# EAGLE schematic projeto_micro_11965988 (EAGLE 9.6.2)
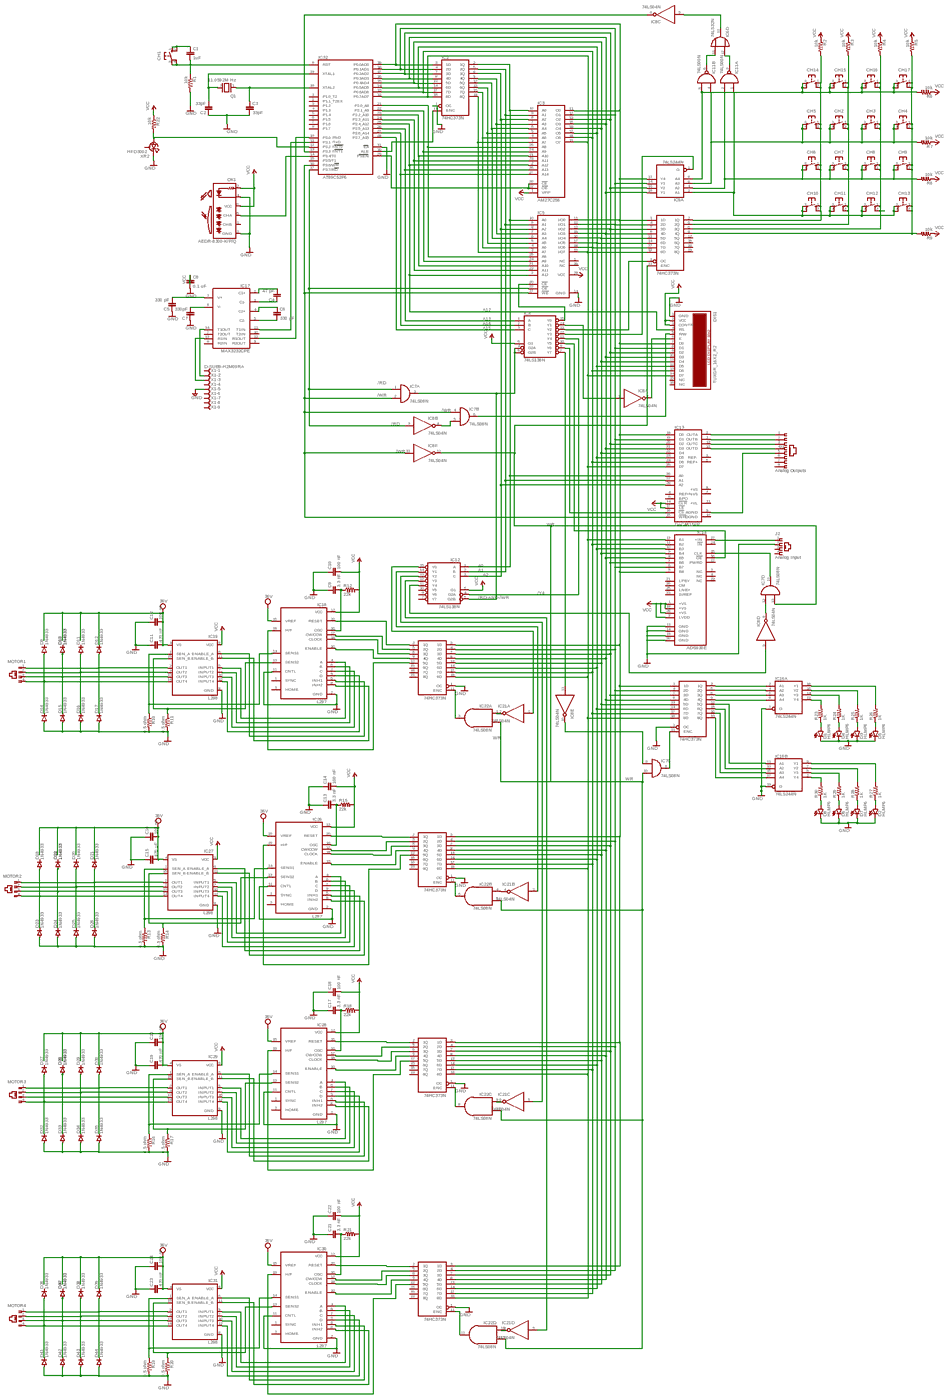
[diagram p0: schematic, sheet 1, overview]
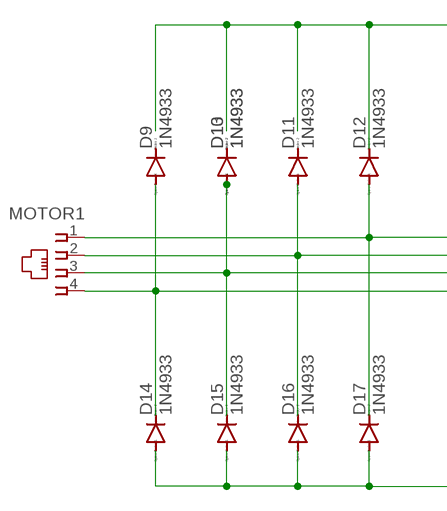
[diagram p1: schematic, sheet 1, part 1 of 4]
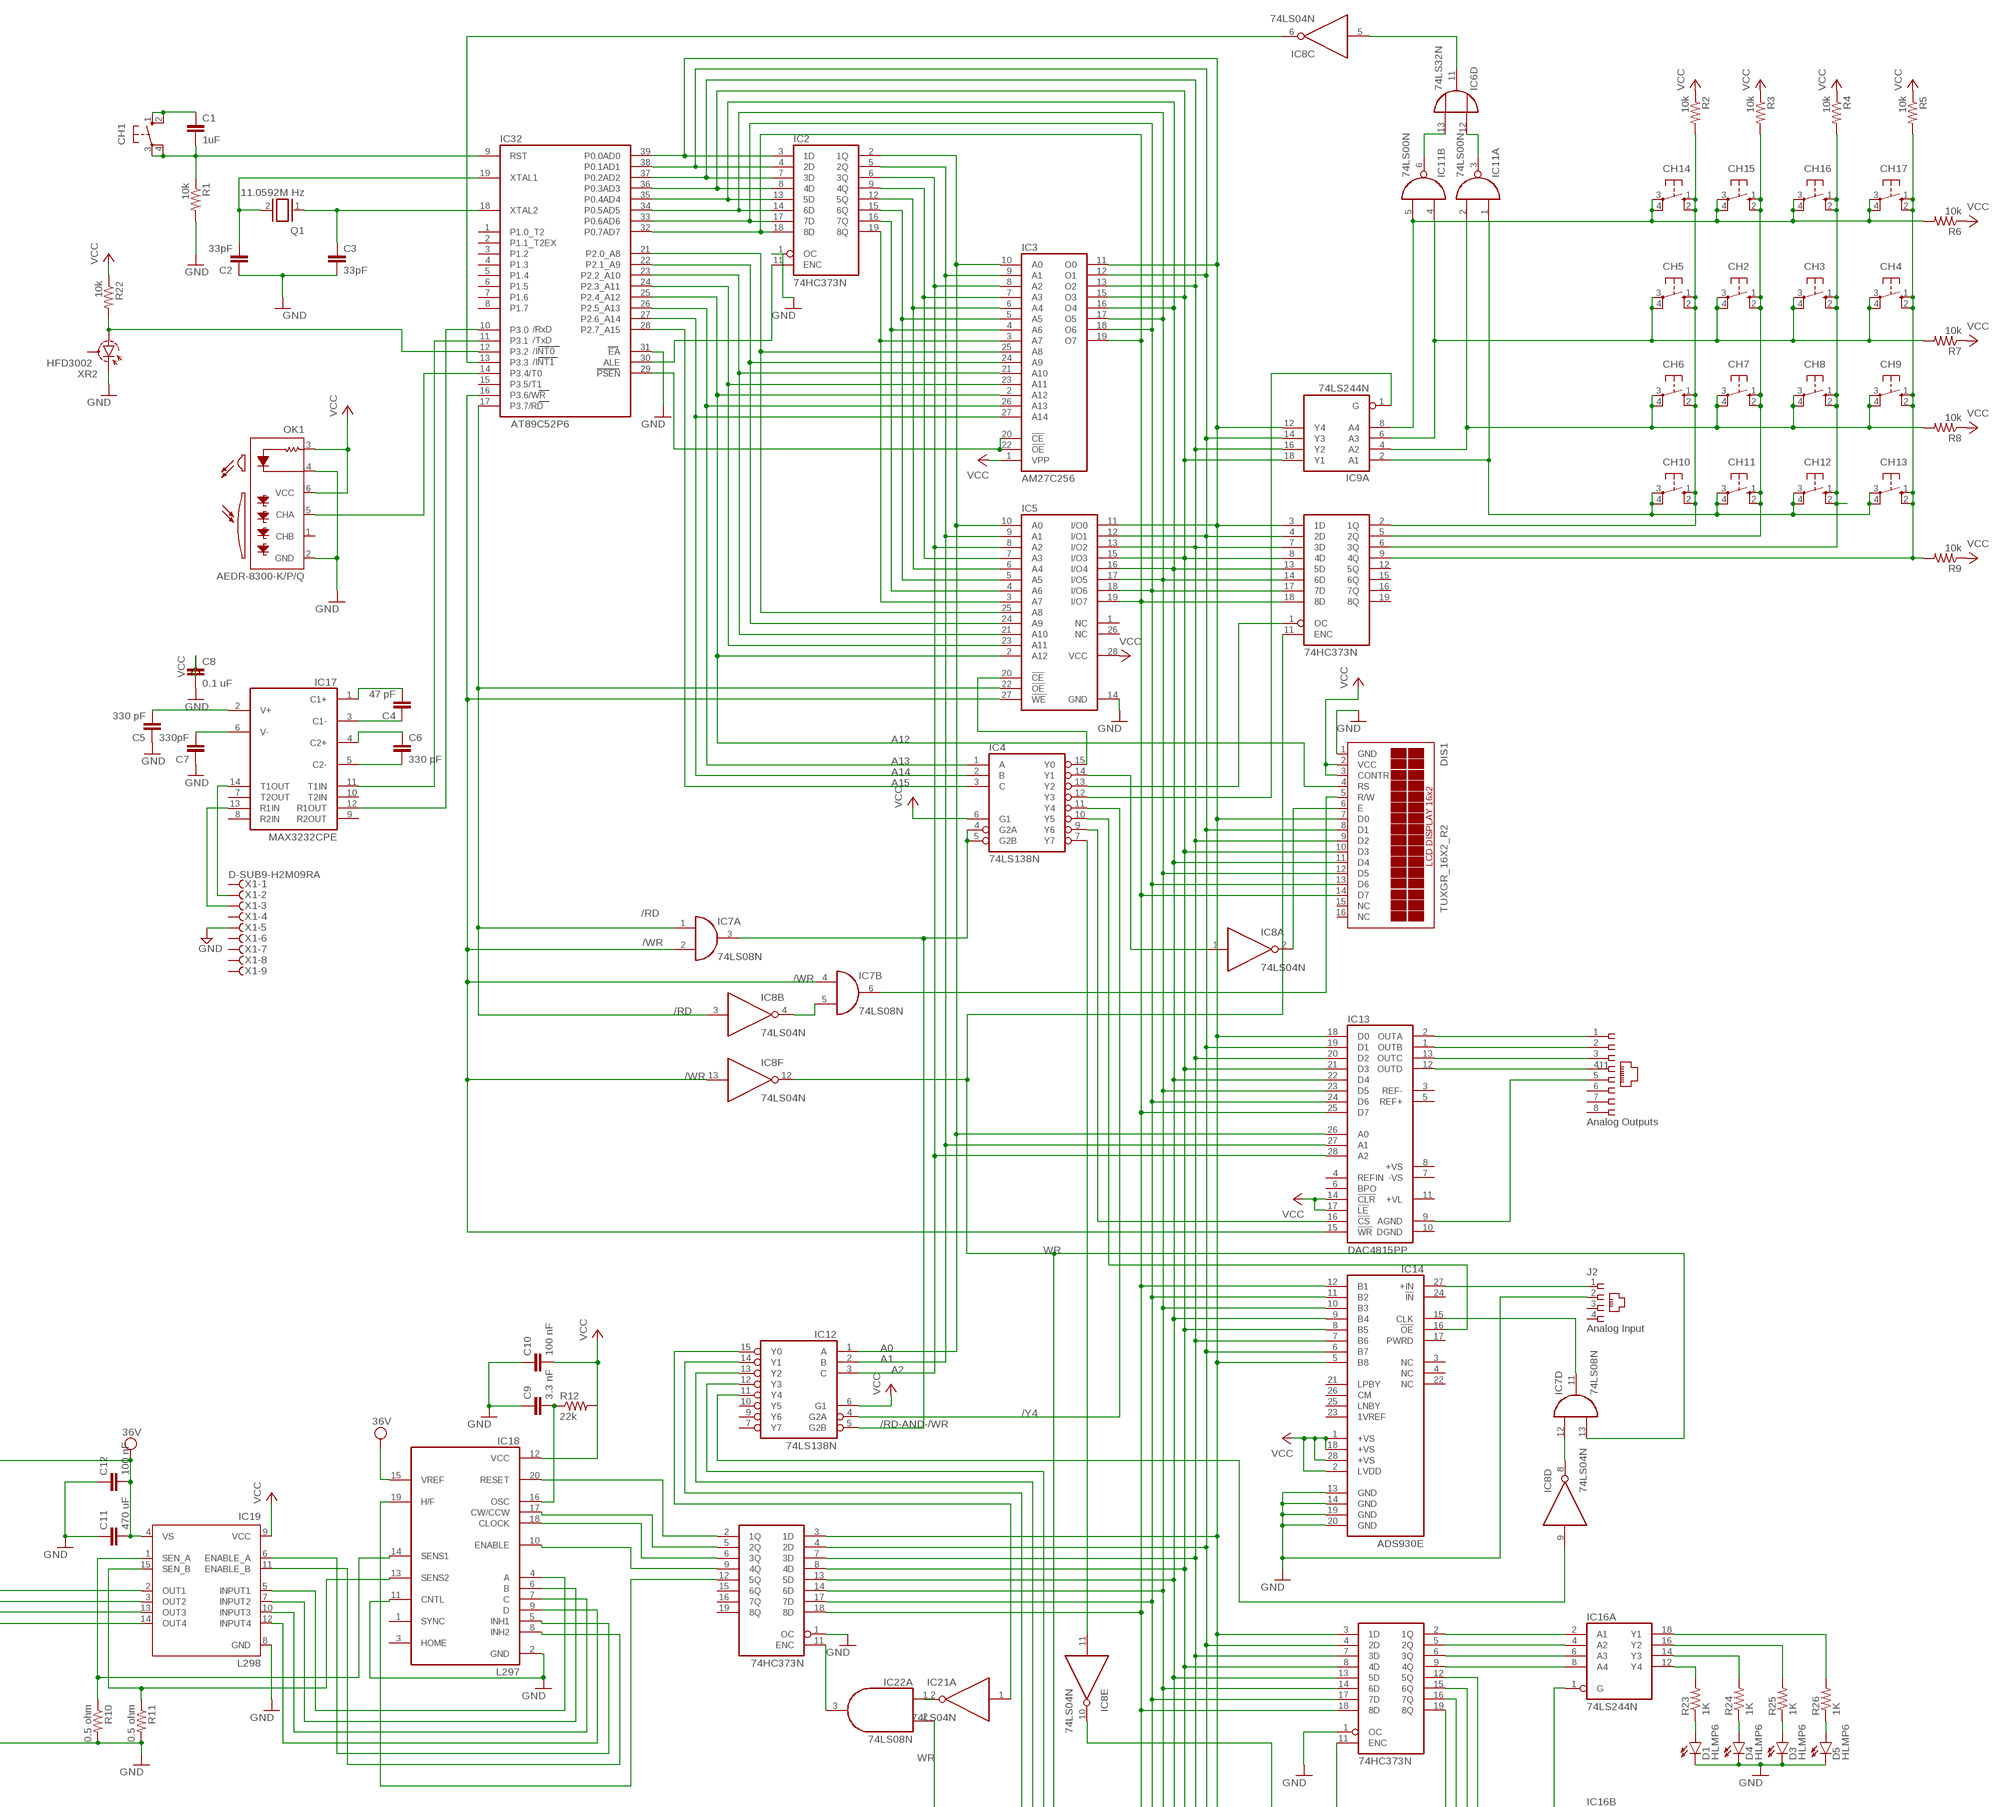
[diagram p2: schematic, sheet 1, part 2 of 4]
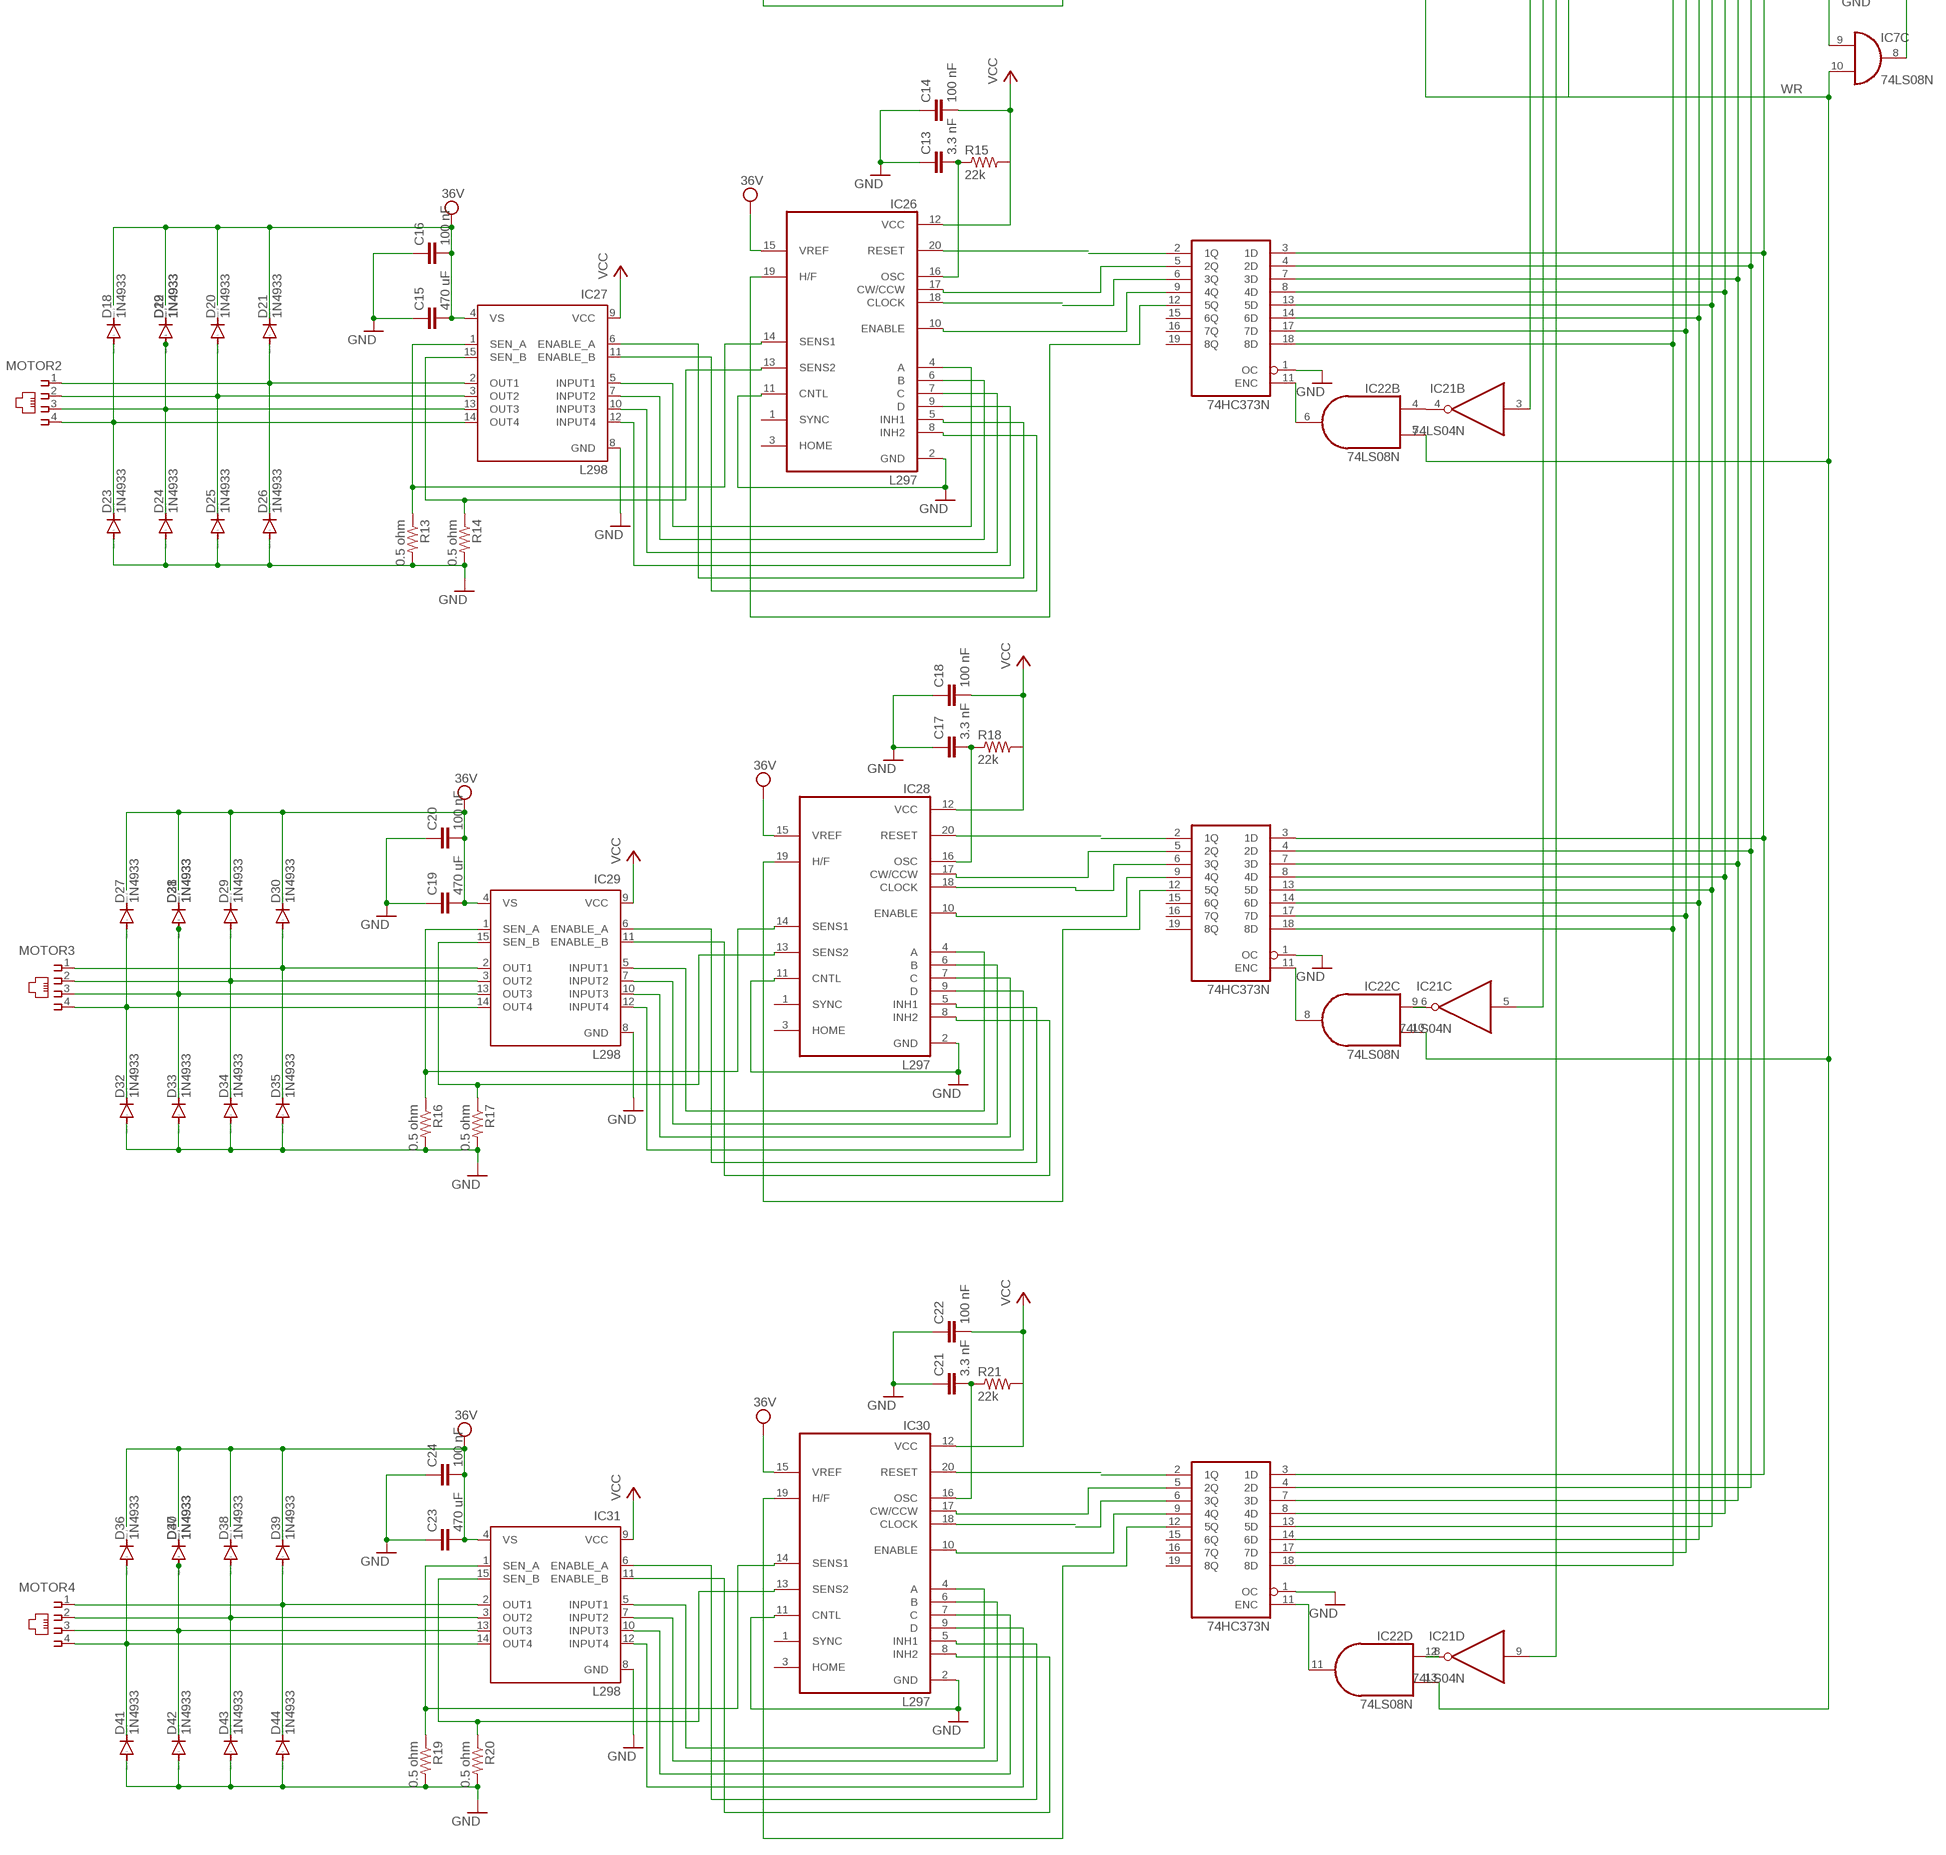
[diagram p3: schematic, sheet 1, part 3 of 4]
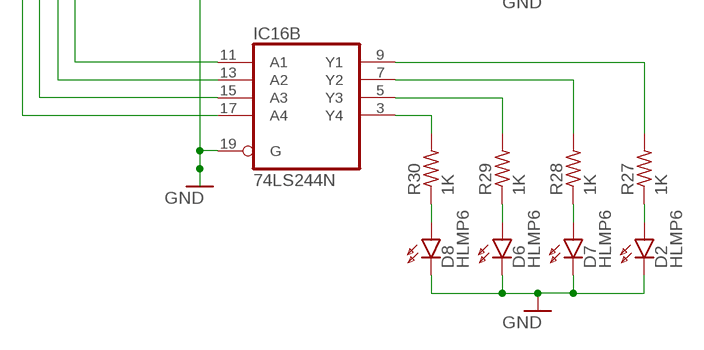
[diagram p4: schematic, sheet 1, part 4 of 4]

## Parts
C1  1uF  C2,5-3  [C2.5-3]
C2  33pF  C2.5/2  [C2.5-2]
C3  33pF  C2.5/2  [C2.5-2]
C4  47 pF  C2.5/2  [C2.5-2]
C5  330 pF  C2.5/2  [C2.5-2]
C6  330 pF  C2.5/2  [C2.5-2]
C7  330pF  C2.5/2  [C2.5-2]
C8  0.1 uF  C2.5/2  [C2.5-2]
C9  3.3 nF  C2.5/2  [C2.5-2]
C10  100 nF  C2.5/2  [C2.5-2]
C11  470 uF  C2.5/2  [C2.5-2]
C12  100 nF  C2.5/2  [C2.5-2]
C13  3.3 nF  C2.5/2  [C2.5-2]
C14  100 nF  C2.5/2  [C2.5-2]
C15  470 uF  C2.5/2  [C2.5-2]
C16  100 nF  C2.5/2  [C2.5-2]
C17  3.3 nF  C2.5/2  [C2.5-2]
C18  100 nF  C2.5/2  [C2.5-2]
C19  470 uF  C2.5/2  [C2.5-2]
C20  100 nF  C2.5/2  [C2.5-2]
C21  3.3 nF  C2.5/2  [C2.5-2]
C22  100 nF  C2.5/2  [C2.5-2]
C23  470 uF  C2.5/2  [C2.5-2]
C24  100 nF  C2.5/2  [C2.5-2]
CH1  10-XX  [B3F-10XX]
CH2  10-XX  [B3F-10XX]
CH3  10-XX  [B3F-10XX]
CH4  10-XX  [B3F-10XX]
CH5  10-XX  [B3F-10XX]
CH6  10-XX  [B3F-10XX]
CH7  10-XX  [B3F-10XX]
CH8  10-XX  [B3F-10XX]
CH9  10-XX  [B3F-10XX]
CH10  10-XX  [B3F-10XX]
CH11  10-XX  [B3F-10XX]
CH12  10-XX  [B3F-10XX]
CH13  10-XX  [B3F-10XX]
CH14  10-XX  [B3F-10XX]
CH15  10-XX  [B3F-10XX]
CH16  10-XX  [B3F-10XX]
CH17  10-XX  [B3F-10XX]
D1  HLMP6  [HLMP6]
D2  HLMP6  [HLMP6]
D3  HLMP6  [HLMP6]
D4  HLMP6  [HLMP6]
D5  HLMP6  [HLMP6]
D6  HLMP6  [HLMP6]
D7  HLMP6  [HLMP6]
D8  HLMP6  [HLMP6]
D9  1N4933  [DO41-10]
D10  1N4933  [DO41-10]
D11  1N4933  [DO41-10]
D12  1N4933  [DO41-10]
D13  1N4933  [DO41-10]
D14  1N4933  [DO41-10]
D15  1N4933  [DO41-10]
D16  1N4933  [DO41-10]
D17  1N4933  [DO41-10]
D18  1N4933  [DO41-10]
D19  1N4933  [DO41-10]
D20  1N4933  [DO41-10]
D21  1N4933  [DO41-10]
D22  1N4933  [DO41-10]
D23  1N4933  [DO41-10]
D24  1N4933  [DO41-10]
D25  1N4933  [DO41-10]
D26  1N4933  [DO41-10]
D27  1N4933  [DO41-10]
D28  1N4933  [DO41-10]
D29  1N4933  [DO41-10]
D30  1N4933  [DO41-10]
D31  1N4933  [DO41-10]
D32  1N4933  [DO41-10]
D33  1N4933  [DO41-10]
D34  1N4933  [DO41-10]
D35  1N4933  [DO41-10]
D36  1N4933  [DO41-10]
D37  1N4933  [DO41-10]
D38  1N4933  [DO41-10]
D39  1N4933  [DO41-10]
D40  1N4933  [DO41-10]
D41  1N4933  [DO41-10]
D42  1N4933  [DO41-10]
D43  1N4933  [DO41-10]
D44  1N4933  [DO41-10]
DIS1  TUXGR_16X2_R2  [TUXGR_16X2_R2]
IC2  74HC373N  [DIL20]
IC3  AM27C256  27256  [DIL28]
IC4  74LS138N  [DIL16]
IC5  28C64C  [DIL28-6]
IC6  74LS32N  [DIL14]
IC7  74LS08N  [DIL14]
IC8  74LS04N  [DIL14]
IC9  74LS244N  [DIL20]
IC10  74HC373N  [DIL20]
IC11  74LS00N  [DIL14]
IC12  74LS138N  [DIL16]
IC13  DAC4815PP  [DIL28]
IC14  ADS930E  [SSOP28BU]
IC15  74HC373N  [DIL20]
IC16  74LS244N  [DIL20]
IC17  MAX3232CPE  [DIL16]
IC18  L297  [DIL20]
IC19  L298  [MULTIWATT-15]
IC20  74HC373N  [DIL20]
IC21  74LS04N  [DIL14]
IC22  74LS08N  [DIL14]
IC23  74HC373N  [DIL20]
IC24  74HC373N  [DIL20]
IC25  74HC373N  [DIL20]
IC26  L297  [DIL20]
IC27  L298  [MULTIWATT-15]
IC28  L297  [DIL20]
IC29  L298  [MULTIWATT-15]
IC30  L297  [DIL20]
IC31  L298  [MULTIWATT-15]
IC32  AT89C52P6  [DIL40]
J1  Analog Outputs  215877-4  [215877-4]
J2  Analog Input  215875-3  [215875-3]
MOTOR1  215876-6  [215876-6]
MOTOR2  215876-6  [215876-6]
MOTOR3  215876-6  [215876-6]
MOTOR4  215876-6  [215876-6]
OK1  AEDR-8300-K/P/Q  [AEDR-8300]
Q1  11.0592M Hz  XTAL  [Q]
R1  10k  R-US_0207/10  [0207/10]
R2  10k  R-US_0207/10  [0207/10]
R3  10k  R-US_0207/10  [0207/10]
R4  10k  R-US_0207/10  [0207/10]
R5  10k  R-US_0207/10  [0207/10]
R6  10k  R-US_0207/10  [0207/10]
R7  10k  R-US_0207/10  [0207/10]
R8  10k  R-US_0207/10  [0207/10]
R9  10k  R-US_0207/10  [0207/10]
R10  0.5 ohm  R-US_0207/10  [0207/10]
R11  0.5 ohm  R-US_0207/10  [0207/10]
R12  22k  R-US_0207/10  [0207/10]
R13  0.5 ohm  R-US_0207/10  [0207/10]
R14  0.5 ohm  R-US_0207/10  [0207/10]
R15  22k  R-US_0207/10  [0207/10]
R16  0.5 ohm  R-US_0207/10  [0207/10]
R17  0.5 ohm  R-US_0207/10  [0207/10]
R18  22k  R-US_0207/10  [0207/10]
R19  0.5 ohm  R-US_0207/10  [0207/10]
R20  0.5 ohm  R-US_0207/10  [0207/10]
R21  22k  R-US_0207/10  [0207/10]
R22  10k  R-US_0207/10  [0207/10]
R23  1K  R-US_0207/10  [0207/10]
R24  1K  R-US_0207/10  [0207/10]
R25  1K  R-US_0207/10  [0207/10]
R26  1K  R-US_0207/10  [0207/10]
R27  1K  R-US_0207/10  [0207/10]
R28  1K  R-US_0207/10  [0207/10]
R29  1K  R-US_0207/10  [0207/10]
R30  1K  R-US_0207/10  [0207/10]
X1  D-SUB9-H2M09RA  [H2M09RA]
XR2  HFD3002  [TO46-FW3]

## Nets
/RD: IC5.22(!OE) IC7.1(A:I0) IC8.3(B:I) IC32.17(P3.7/RD)
/RD-AND-/WR: IC4.4(G2A) IC4.5(G2B) IC7.3(A:O) IC12.5(G2B)
/WR: IC5.27(!WE) IC7.2(A:I1) IC7.4(B:I0) IC8.13(F:I) IC13.15(!WR) IC32.16(P3.6/WR)
/Y4: IC4.11(Y4) IC12.4(G2A)
A0: IC2.2(1Q) IC3.10(A0) IC5.10(A0) IC12.1(A) IC13.26(A0)
A1: IC2.5(2Q) IC3.9(A1) IC5.9(A1) IC12.2(B) IC13.27(A1)
A2: IC2.6(3Q) IC3.8(A2) IC5.8(A2) IC12.3(C) IC13.28(A2)
A12: DIS1.4(RS) IC3.2(A12) IC5.2(A12) IC32.25(P2.4_A12)
A13: IC3.26(A13) IC4.1(A) IC32.26(P2.5_A13)
A14: IC3.27(A14) IC4.2(B) IC32.27(P2.6_A14)
A15: IC4.3(C) IC32.28(P2.7_A15)
GND: C2.1 C3.2 C5.1 C7.1 C8.2 C9.1 C10.1 C11.1 C12.1 C13.1 C14.1 C15.1 C16.1 C17.1 C18.1 C19.1 C20.1 C21.1 C22.1 C23.1 C24.1 D1.K D2.K D3.K D4.K D5.K D6.K D7.K D8.K D14.A D15.A D16.A D17.A D23.A D24.A D25.A D26.A D32.A D33.A D34.A D35.A D41.A D42.A D43.A D44.A DIS1.1(GND) IC2.1(OC) IC5.14(GND) IC14.13(GND) IC14.14(GND) IC14.19(GND) IC14.20(GND) IC15.1(OC) IC16.1(A:G) IC16.19(B:G) IC18.2(GND) IC18.11(CNTL) IC19.8(GND) IC20.1(OC) IC23.1(OC) IC24.1(OC) IC25.1(OC) IC26.2(GND) IC26.11(CNTL) IC27.8(GND) IC28.2(GND) IC28.11(CNTL) IC29.8(GND) IC30.2(GND) IC30.11(CNTL) IC31.8(GND) IC32.31(EA) J2.2 OK1.2(GND) OK1.4(C) R1.2 R10.2 R11.2 R13.2 R14.2 R16.2 R17.2 R19.2 R20.2 X1.5 XR2.2(C)
N$1: C2.2 IC32.19(XTAL1) Q1.2
N$2: C1.1 CH1.1(S) CH1.2(S1)
N$3: C1.2 CH1.3(P) CH1.4(P1) IC32.9(RST) R1.1
N$4: C3.1 IC32.18(XTAL2) Q1.1
N$5: DIS1.7(D0) IC2.3(1D) IC3.11(O0) IC5.11(I/O0) IC9.12(A:Y4) IC10.3(1D) IC13.18(D0) IC14.5(B8) IC15.3(1D) IC20.3(1D) IC23.3(1D) IC24.3(1D) IC25.3(1D) IC32.39(P0.0AD0)
N$6: DIS1.8(D1) IC2.4(2D) IC3.12(O1) IC5.12(I/O1) IC9.14(A:Y3) IC10.4(2D) IC13.19(D1) IC14.6(B7) IC15.4(2D) IC20.4(2D) IC23.4(2D) IC24.4(2D) IC25.4(2D) IC32.38(P0.1AD1)
N$7: DIS1.9(D2) IC2.7(3D) IC3.13(O2) IC5.13(I/O2) IC9.16(A:Y2) IC10.7(3D) IC13.20(D2) IC14.7(B6) IC15.7(3D) IC20.7(3D) IC23.7(3D) IC24.7(3D) IC25.7(3D) IC32.37(P0.2AD2)
N$8: DIS1.10(D3) IC2.8(4D) IC3.15(O3) IC5.15(I/O3) IC9.18(A:Y1) IC10.8(4D) IC13.21(D3) IC14.8(B5) IC15.8(4D) IC20.8(4D) IC23.8(4D) IC24.8(4D) IC25.8(4D) IC32.36(P0.3AD3)
N$9: DIS1.11(D4) IC2.13(5D) IC3.16(O4) IC5.16(I/O4) IC10.13(5D) IC13.22(D4) IC14.9(B4) IC15.13(5D) IC20.13(5D) IC23.13(5D) IC24.13(5D) IC25.13(5D) IC32.35(P0.4AD4)
N$10: DIS1.12(D5) IC2.14(6D) IC3.17(O5) IC5.17(I/O5) IC10.14(6D) IC13.23(D5) IC14.10(B3) IC15.14(6D) IC20.14(6D) IC23.14(6D) IC24.14(6D) IC25.14(6D) IC32.34(P0.5AD5)
N$11: DIS1.13(D6) IC2.17(7D) IC3.18(O6) IC5.18(I/O6) IC10.17(7D) IC13.24(D6) IC14.11(B2) IC15.17(7D) IC20.17(7D) IC23.17(7D) IC24.17(7D) IC25.17(7D) IC32.33(P0.6AD6)
N$12: DIS1.14(D7) IC2.18(8D) IC3.19(O7) IC5.19(I/O7) IC10.18(8D) IC13.25(D7) IC14.12(B1) IC15.18(8D) IC20.18(8D) IC23.18(8D) IC24.18(8D) IC25.18(8D) IC32.32(P0.7AD7)
N$13: IC2.19(8Q) IC3.3(A7) IC5.3(A7)
N$14: IC2.16(7Q) IC3.4(A6) IC5.4(A6)
N$15: IC2.15(6Q) IC3.5(A5) IC5.5(A5)
N$16: IC2.12(5Q) IC3.6(A4) IC5.6(A4)
N$17: IC2.9(4Q) IC3.7(A3) IC5.7(A3)
N$18: IC13.2(OUTA) J1.1
N$19: IC13.1(OUTB) J1.2
N$20: IC13.13(OUTC) J1.3
N$21: IC3.25(A8) IC5.25(A8) IC32.21(P2.0_A8)
N$22: IC3.24(A9) IC5.24(A9) IC32.22(P2.1_A9)
N$23: IC3.21(A10) IC5.21(A10) IC32.23(P2.2_A10)
N$24: IC3.23(A11) IC5.23(A11) IC32.24(P2.3_A11)
N$25: IC13.12(OUTD) J1.4
N$26: IC13.9(AGND) J1.5
N$27: IC14.27(+IN) J2.1
N$28: IC7.12(D:I0) IC8.8(D:O)
N$29: IC8.9(D:I) IC12.11(Y4)
N$31: IC3.20(!CE) IC3.22(!OE) IC32.29(PSEN)
N$32: IC7.11(D:O) IC14.15(CLK)
N$33: IC7.5(B:I1) IC8.4(B:O)
N$34: IC2.11(ENC) IC32.30(ALE)
N$38: DIS1.6(E) IC8.2(A:O)
N$39: IC4.14(Y1) IC8.1(A:I)
N$40: DIS1.5(R/W) IC7.6(B:O)
N$41: IC4.13(Y2) IC10.1(OC)
N$42: IC4.12(Y3) IC9.1(A:G)
N$43: IC6.12(D:I0) IC11.3(A:O)
N$44: IC6.13(D:I1) IC11.6(B:O)
N$45: IC6.11(D:O) IC8.5(C:I)
N$46: C4.1 IC17.3(C1-)
N$47: C4.2 IC17.1(C1+)
N$48: C5.2 IC17.2(V+)
N$49: C6.2 IC17.5(C2-)
N$50: IC8.6(C:O) IC32.13(P3.3)
N$51: IC4.9(Y6) IC13.16(!CS)
N$53: IC4.10(Y5) IC14.16(!OE)
N$55: IC7.9(C:I0) IC8.10(E:O)
N$56: IC15.2(1Q) IC16.2(A:A1)
N$57: IC21.6(C:O) IC22.9(C:I0)
N$58: IC7.8(C:O) IC15.11(ENC)
N$59: IC15.5(2Q) IC16.4(A:A2)
N$60: IC15.6(3Q) IC16.6(A:A3)
N$61: IC15.9(4Q) IC16.8(A:A4)
N$62: IC15.19(8Q) IC16.17(B:A4)
N$63: IC15.16(7Q) IC16.15(B:A3)
N$64: IC15.15(6Q) IC16.13(B:A2)
N$65: IC15.12(5Q) IC16.11(B:A1)
N$66: D1.A IC16.12(A:Y4) R23.1 R23.2
N$67: D4.A R24.1
N$68: D3.A R25.1
N$69: D5.A R26.1
N$70: D8.A IC16.3(B:Y4) R30.1 R30.2
N$71: D6.A R29.1
N$72: D7.A R28.1
N$73: D2.A R27.1
N$74: CH5.1(S) CH5.2(S1) CH6.1(S) CH6.2(S1) CH10.1(S) CH10.2(S1) CH14.1(S) CH14.2(S1) IC10.2(1Q) R2.2
N$75: CH2.1(S) CH2.2(S1) CH7.1(S) CH7.2(S1) CH11.1(S) CH11.2(S1) CH15.1(S) CH15.2(S1) IC10.5(2Q) R3.2
N$76: CH3.1(S) CH3.2(S1) CH8.1(S) CH8.2(S1) CH12.1(S) CH12.2(S1) CH16.1(S) CH16.2(S1) IC10.6(3Q) R4.2
N$77: CH4.1(S) CH4.2(S1) CH9.1(S) CH9.2(S1) CH13.1(S) CH13.2(S1) CH17.1(S) CH17.2(S1) IC10.9(4Q) R5.2 R9.2
N$78: C6.1 IC17.4(C2+)
N$79: C7.2 IC17.6(V-)
N$80: CH14.3(P) CH14.4(P1) CH15.3(P) CH15.4(P1) CH16.3(P) CH16.4(P1) CH17.3(P) CH17.4(P1) IC9.8(A:A4) IC11.5(B:I1) R6.2
N$81: IC17.11(T1IN) IC32.11(P3.1)
N$82: IC17.12(R1OUT) IC32.10(P3.0)
N$83: IC17.14(T1OUT) X1.2
N$84: CH2.3(P) CH2.4(P1) CH3.3(P) CH3.4(P1) CH4.3(P) CH4.4(P1) CH5.3(P) CH5.4(P1) IC9.6(A:A3) IC11.4(B:I0) R7.2
N$85: IC17.13(R1IN) X1.3
N$86: IC20.11(ENC) IC22.3(A:O)
N$87: IC12.15(Y0) IC21.1(A:I)
N$88: CH6.3(P) CH6.4(P1) CH7.3(P) CH7.4(P1) CH8.3(P) CH8.4(P1) CH9.3(P) CH9.4(P1) IC9.4(A:A2) IC11.2(A:I1) R8.2
N$89: IC21.2(A:O) IC22.1(A:I0)
N$90: IC4.7(Y7) IC8.11(E:I)
N$91: IC21.8(D:O) IC22.12(D:I0)
N$92: CH10.3(P) CH10.4(P1) CH11.3(P) CH11.4(P1) CH12.3(P) CH12.4(P1) CH13.3(P) CH13.4(P1) IC9.2(A:A1) IC11.1(A:I0)
N$93: IC21.4(B:O) IC22.4(B:I0)
N$94: IC12.14(Y1) IC21.3(B:I)
N$95: IC12.13(Y2) IC21.5(C:I)
N$96: IC12.12(Y3) IC21.9(D:I)
N$97: IC18.20(RESET) IC20.2(1Q)
N$98: IC18.4(A) IC19.5(INPUT1)
N$99: IC22.6(B:O) IC23.11(ENC)
N$100: IC22.8(C:O) IC24.11(ENC)
N$101: IC22.11(D:O) IC25.11(ENC)
N$102: IC18.18(CLOCK) IC20.6(3Q)
N$103: IC18.10(ENABLE) IC20.9(4Q)
N$104: IC18.17(CW/CCW) IC20.5(2Q)
N$105: C9.2 IC18.16(OSC) R12.1
N$106: IC18.6(B) IC19.7(INPUT2)
N$107: IC18.7(C) IC19.10(INPUT3)
N$108: IC18.9(D) IC19.12(INPUT4)
N$109: IC18.5(INH1) IC19.6(ENABLE_A)
N$110: IC18.8(INH2) IC19.11(ENABLE_B)
N$111: IC18.14(SENS1) IC19.1(SEN_A) R10.1
N$112: IC18.13(SENS2) IC19.15(SEN_B) R11.1
N$113: D9.A D14.C IC19.14(OUT4) MOTOR1.4
N$114: D10.A D13.A D15.C IC19.13(OUT3) MOTOR1.3
N$115: D10.C D13.C
N$116: D11.A D16.C IC19.3(OUT2) MOTOR1.2
N$117: D12.A D17.C IC19.2(OUT1) MOTOR1.1
N$118: IC18.19(H/F) IC20.12(5Q)
N$119: IC23.2(1Q)
N$120: IC26.20(RESET)
N$121: IC26.18(CLOCK)
N$122: IC23.9(4Q) IC26.10(ENABLE)
N$123: IC23.5(2Q) IC26.17(CW/CCW)
N$124: IC26.4(A) IC27.5(INPUT1)
N$125: IC26.6(B) IC27.7(INPUT2)
N$126: IC26.7(C) IC27.10(INPUT3)
N$127: IC26.9(D) IC27.12(INPUT4)
N$128: IC26.5(INH1) IC27.6(ENABLE_A)
N$129: IC26.8(INH2) IC27.11(ENABLE_B)
N$130: IC26.14(SENS1) IC27.1(SEN_A) R13.1
N$131: IC26.13(SENS2) IC27.15(SEN_B) R14.1
N$132: C13.2 IC26.16(OSC) R15.1
N$133: D19.A D22.A D24.C IC27.13(OUT3) MOTOR2.3
N$134: D19.C D22.C
N$135: D18.A D23.C IC27.14(OUT4) MOTOR2.4
N$136: D20.A D25.C IC27.3(OUT2) MOTOR2.2
N$137: D21.A D26.C IC27.2(OUT1) MOTOR2.1
N$138: IC23.12(5Q) IC26.19(H/F)
N$139: IC28.20(RESET)
N$140: IC24.6(3Q) IC28.18(CLOCK)
N$141: IC24.9(4Q) IC28.10(ENABLE)
N$142: IC24.5(2Q) IC28.17(CW/CCW)
N$143: IC28.4(A) IC29.5(INPUT1)
N$144: IC28.6(B) IC29.7(INPUT2)
N$145: IC28.7(C) IC29.10(INPUT3)
N$146: IC28.9(D) IC29.12(INPUT4)
N$147: IC28.5(INH1) IC29.6(ENABLE_A)
N$148: IC28.8(INH2) IC29.11(ENABLE_B)
N$149: IC28.14(SENS1) IC29.1(SEN_A) R16.1
N$150: IC28.13(SENS2) IC29.15(SEN_B) R17.1
N$151: C17.2 IC28.16(OSC) R18.1
N$152: D28.A D31.A D33.C IC29.13(OUT3) MOTOR3.3
N$153: D28.C D31.C
N$154: D27.A D32.C IC29.14(OUT4) MOTOR3.4
N$155: D29.A D34.C IC29.3(OUT2) MOTOR3.2
N$156: D30.A D35.C IC29.2(OUT1) MOTOR3.1
N$157: IC24.12(5Q) IC28.19(H/F)
N$158: IC30.20(RESET)
N$159: IC30.18(CLOCK)
N$160: IC25.9(4Q) IC30.10(ENABLE)
N$161: IC25.5(2Q) IC30.17(CW/CCW)
N$162: IC30.4(A) IC31.5(INPUT1)
N$163: IC30.6(B) IC31.7(INPUT2)
N$164: IC30.7(C) IC31.10(INPUT3)
N$165: IC30.9(D) IC31.12(INPUT4)
N$166: IC30.5(INH1) IC31.6(ENABLE_A)
N$167: IC30.8(INH2) IC31.11(ENABLE_B)
N$168: IC30.14(SENS1) IC31.1(SEN_A) R19.1
N$169: IC30.13(SENS2) IC31.15(SEN_B) R20.1
N$170: C21.2 IC30.16(OSC) R21.1
N$171: D37.A D40.A D42.C IC31.13(OUT3) MOTOR4.3
N$172: D37.C D40.C
N$173: D36.A D41.C IC31.14(OUT4) MOTOR4.4
N$174: D38.A D43.C IC31.3(OUT2) MOTOR4.2
N$175: D39.A D44.C IC31.2(OUT1) MOTOR4.1
N$176: IC25.12(5Q) IC30.19(H/F)
N$177: IC23.6(3Q)
N$178: IC24.2(1Q)
N$179: IC25.2(1Q)
N$180: IC25.6(3Q)
N$181: IC32.14(P3.4/T0) OK1.5(CHA)
N$182: IC32.12(P3.2) R22.2 XR2.1(A)
N$183: IC16.14(A:Y3) R24.2
N$184: IC16.16(A:Y2) R25.2
N$185: IC16.18(A:Y1) R26.2
N$186: IC4.15(Y0) IC5.20(!CE)
N$187: IC16.5(B:Y3) R29.2
N$188: IC16.7(B:Y2) R28.2
N$189: IC16.9(B:Y1) R27.2
VCC: C8.1 C10.2 C11.2 C12.2 C14.2 C15.2 C16.2 C18.2 C19.2 C20.2 C22.2 C23.2 C24.2 D12.C D21.C D30.C D39.C DIS1.2(VCC) DIS1.3(CONTR) IC3.1(VPP) IC4.6(G1) IC5.28(VCC) IC12.6(G1) IC13.14(!CLR) IC13.17(!LE) IC14.1(+VS) IC14.2(LVDD) IC14.18(+VS) IC14.28(+VS) IC18.12(VCC) IC18.15(VREF) IC19.4(VS) IC19.9(VCC) IC26.12(VCC) IC26.15(VREF) IC27.4(VS) IC27.9(VCC) IC28.12(VCC) IC28.15(VREF) IC29.4(VS) IC29.9(VCC) IC30.12(VCC) IC30.15(VREF) IC31.4(VS) IC31.9(VCC) OK1.3(A) OK1.6(VCC) R2.1 R3.1 R4.1 R5.1 R6.1 R7.1 R8.1 R9.1 R12.2 R15.2 R18.2 R21.2 R22.1 ; supply symbol labelled 36V
WR: IC7.10(C:I1) IC7.13(D:I1) IC8.12(F:O) IC10.11(ENC) IC22.2(A:I1) IC22.5(B:I1) IC22.10(C:I1) IC22.13(D:I1)
Unconnected: D9.C D11.C D18.C D20.C D27.C D29.C D36.C D38.C DIS1.15(NC) DIS1.16(NC) IC5.1(NC) IC5.26(NC) IC6.1(A:I0) IC6.2(A:I1) IC6.3(A:O) IC6.4(B:I0) IC6.5(B:I1) IC6.6(B:O) IC6.8(C:O) IC6.9(C:I0) IC6.10(C:I1) IC9.3(B:Y4) IC9.5(B:Y3) IC9.7(B:Y2) IC9.9(B:Y1) IC9.11(B:A1) IC9.13(B:A2) IC9.15(B:A3) IC9.17(B:A4) IC9.19(B:G) IC10.12(5Q) IC10.15(6Q) IC10.16(7Q) IC10.19(8Q) IC11.8(C:O) IC11.9(C:I0) IC11.10(C:I1) IC11.11(D:O) IC11.12(D:I0) IC11.13(D:I1) IC12.7(Y7) IC12.9(Y6) IC12.10(Y5) IC13.3(REF-) IC13.4(REFIN) IC13.5(REF+) IC13.6(BPO) IC14.3(NC) IC14.4(NC) IC14.17(PWRD) IC14.21(LPBY) IC14.22(NC) IC14.23(1VREF) IC14.24(!IN) IC14.25(LNBY) IC14.26(CM) IC17.7(T2OUT) IC17.8(R2IN) IC17.9(R2OUT) IC17.10(T2IN) IC18.1(SYNC) IC18.3(HOME) IC20.15(6Q) IC20.16(7Q) IC20.19(8Q) IC21.10(E:O) IC21.11(E:I) IC21.12(F:O) IC21.13(F:I) IC23.15(6Q) IC23.16(7Q) IC23.19(8Q) IC24.15(6Q) IC24.16(7Q) IC24.19(8Q) IC25.15(6Q) IC25.16(7Q) IC25.19(8Q) IC26.1(SYNC) IC26.3(HOME) IC28.1(SYNC) IC28.3(HOME) IC30.1(SYNC) IC30.3(HOME) IC32.1(P1.0_T2) IC32.2(P1.1_T2EX) IC32.3(P1.2) IC32.4(P1.3) IC32.5(P1.4) IC32.6(P1.5) IC32.7(P1.6) IC32.8(P1.7) IC32.15(P3.5/T1) J1.6 J1.7 J1.8 J2.3 J2.4 OK1.1(CHB) X1.1 X1.4 X1.6 X1.7 X1.8 X1.9 XR2.3(S)

## Power pins joined to a net without a drawn wire
+VL: IC13.11(+VL)
+VS: IC13.8(+VS)
-VS: IC13.7(-VS)
DGND: IC13.10(DGND)
GND: IC2.10(GND) IC3.14(GND) IC4.8(GND) IC6.7(P:GND) IC7.7(P:GND) IC8.7(P:GND) IC9.10(P:GND) IC10.10(GND) IC11.7(P:GND) IC12.8(GND) IC15.10(GND) IC16.10(P:GND) IC17.15(GND) IC20.10(GND) IC21.7(P:GND) IC22.7(P:GND) IC23.10(GND) IC24.10(GND) IC25.10(GND) IC32.20(GND) OK1.E1(GND) OK1.E2(GND)
VCC: IC2.20(VCC) IC3.28(VCC) IC4.16(VCC) IC6.14(P:VCC) IC7.14(P:VCC) IC8.14(P:VCC) IC9.20(P:VCC) IC10.20(VCC) IC11.14(P:VCC) IC12.16(VCC) IC15.20(VCC) IC16.20(P:VCC) IC17.16(VCC) IC20.20(VCC) IC21.14(P:VCC) IC22.14(P:VCC) IC23.20(VCC) IC24.20(VCC) IC25.20(VCC) IC32.40(VCC)

## Library data of the parts
C1-C24 = capacitor-wima:C: CAPACITOR naming: grid - package width
CH1-CH17 = switch-omron:10-XX: OMRON SWITCH; MPN: B3F-1000; OC_FARNELL: 176432; OC_NEWARK: 36M3542
D1-D8 = display-hp:HLMP6: LED 2mm horizontal; MF: AGILENT TECHNOLOGIES; MPN: HLMP-6500; OC_FARNELL: 1652490; OC_NEWARK: 40K0088
D9-D44 = diode:1N4933: DIODE fast recovery rectifier, 1A
DIS1 = display-lcd:TUXGR_16X2_R2: Tuxgraphics LCD display 16x2 characters reflective, without background light Source: tuxgr_12x2_r2.pdf; OC_FARNELL: unknown; OC_NEWARK: unknown
IC2 IC10 IC15 IC20 IC23-IC25 = 74xx-eu:74*373: Octal D type transparent LATCH, edge triggered
IC3 = memory:27256: MEMORY
IC4 IC12 = 74xx-us:74*138: 3-line to 8-line DECODER/DEMULTIPLEXER
IC5 = memory-nec:28C64C: MEMORY; MPN: AT28C64B-15PU; OC_FARNELL: 1095784; OC_NEWARK: 96K6557
IC6 = 74xx-eu:74*32: Quad 2-input OR gate
IC7 = 74xx-eu:74*08: Quad 2-input AND gate
IC8 = 74xx-eu:74*04: Hex INVERTER
IC9 IC16 = 74xx-eu:74*244: Octal BUFFER and LINE DRIVER, 3-state
IC11 = 74xx-eu:74*00: Quad 2-input NAND gate
IC13 = burr-brown:DAC4815P: Quad 12-Bit DAC 8-Bit Port Interface; OC_FARNELL: unknown; OC_NEWARK: unknown
IC14 = burr-brown:ADS930: 8-Bit, 30 MSPS ADC SE/Diff Inputs Internal Ref. and Low Power, Powerdown; MPN: AD9280ARSZ; OC_FARNELL: 9603727; OC_NEWARK: 19M1009
IC17 = maxim:MAX3232*: True RS-232 Transceivers 3.0V to 5.5V, Low-Power up to 1Mbps, Using Four 0.1µF External Capacitors Source: http://pdfserv.maxim-ic.com/en/ds/MAX3222-MAX3241.pdf; MF: MAXIM; MPN: MAX3232CPE+; OC_FARNELL: 9724494; OC_NEWARK: 68K4626
IC18 IC26 IC28 IC30 = st-microelectronics:L297: STEPPER MOTOR CONTROLLER; MPN: L297/1; OC_FARNELL: 1094209; OC_NEWARK: 56P8258
IC19 IC27 IC29 IC31 = st-microelectronics:L298: DUAL FULL-BRIDGE DRIVER; MPN: L298N; OC_FARNELL: 1589425; OC_NEWARK: 32M1527
IC21 = 74xx-us:74*04: Hex INVERTER
IC22 = 74xx-us:74*08: Quad 2-input AND gate
IC32 = atmel:AT89C*52: MICROCONTROLLER 8 Kbytes FLASH; 2K Bytes EEPROM Compatible with MCS-51 Products at89s8252.pdf; OC_FARNELL: unknown; OC_NEWARK: unknown
J1 = con-amp:215877-4: AMP connector
J2 = con-amp:215875-3: AMP connector
MOTOR1-MOTOR4 = con-amp:215876-6: AMP connector
OK1 = optocoupler:AEDR-8300-K: Agilent AEDR-8300 Series Encoders Reflective Surface Mount Optical Encoder Source: http: http://www.avagotech.com .. AV02-0088EN-1.pdf; MF: AGILENT TECHNOLOGIES; MPN: AEDR-8300-1P2; OC_FARNELL: 1161102; OC_NEWARK: 08J1020
Q1 = special:XTAL: CRYSTAL
R1-R30 = rcl:R-US_: RESISTOR, American symbol; SPICEPREFIX: R
X1 = con-thomas-betts:D-SUB9-: D-Subminiatur Connector Source: Electronioc Interconnects European Edition 1998; OC_FARNELL: unknown; OC_NEWARK: unknown
XR2 = opto-honeywell:HFD3002: OPTO SENSOR DEVICE; OC_FARNELL: unknown; OC_NEWARK: unknown